# Altium schematic sheet BPadapter_Connectors.SchDoc: PCB
size A4
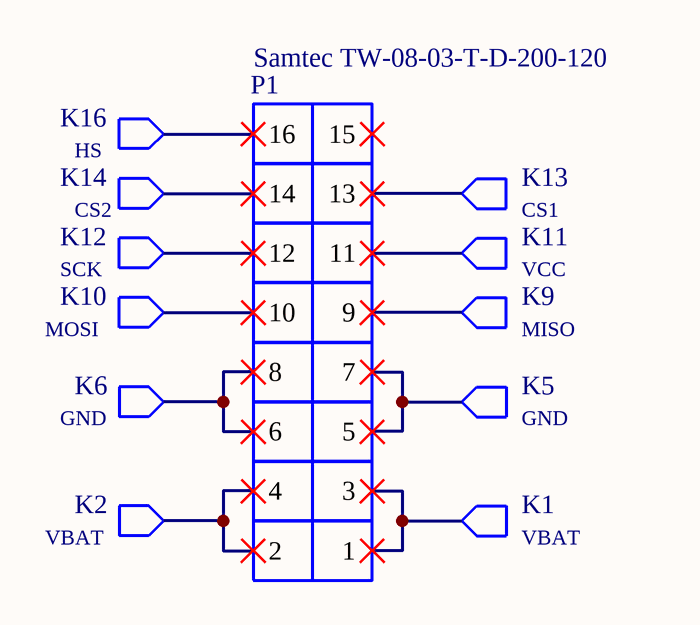
[diagram p0: BPadapter_Connectors.SchDoc]

## Parts
K1  VBAT  [wire-awg24-1_stress-relief]
K2  VBAT  [wire-awg24-1_stress-relief]
K5  GND  [wire-awg24-1_stress-relief]
K6  GND  [wire-awg24-1_stress-relief]
K9  MISO  [wire-awg26-1_stress-relief]
K10  MOSI  [wire-awg26-1_stress-relief]
K11  VCC  [wire-awg26-1_stress-relief]
K12  SCK  [wire-awg26-1_stress-relief]
K13  CS1  [wire-awg26-1_stress-relief]
K14  CS2  [wire-awg26-1_stress-relief]
K16  HS  [wire-awg26-1_stress-relief]
P1  value Samtec TW-08-03-T-D-200-120  [Samtec_TW-08-03-T-D-200-120]  (hidden comment: Samtec_TW-08-03-T-D-200-120)

## Nets
NetK1_1: K1.1 P1.1 P1.3
NetK2_1: K2.1 P1.2 P1.4
NetK5_1: K5.1 P1.5 P1.7
NetK6_1: K6.1 P1.6 P1.8
NetK9_1: K9.1 P1.9
NetK10_1: K10.1 P1.10
NetK11_1: K11.1 P1.11
NetK12_1: K12.1 P1.12
NetK13_1: K13.1 P1.13
NetK14_1: K14.1 P1.14
NetK16_1: K16.1 P1.16

Not connected (* = marked no-connect by the designer): P1 15*

## Notes on the sheet
- Title:
- Project:
- Author:
- Model:
- Document Number:
- Checked by:
- Rev:
- Date:
- Approved by:
- Sheet:
- of
- File name:

## Library data of the parts
K1 K2 K5 K6 = wire-awg24-1: Single wire AWG24 solder point.
  K1 K2: Value: VBAT
  K5 K6: Value: GND
K9-K14 K16 = wire-awg26-1: Single wire AWG26 solder point.
  K9: Value: MISO
  K10: Value: MOSI
  K11: Value: VCC
  K12: Value: SCK
  K13: Value: CS1
  K14: Value: CS2
  K16: Value: HS
P1 = Samtec_TW-08-03-T-D-200-120: Samtec TW Series Header, 2mm pitch, 2x8pin.; HelpUrl: http://suddendocs.samtec.com/catalog_english/tw_th.pdf